# Altium schematic sheet Zynq_PS_System.SchDoc: Zynq PS System (part 1 of 2)
size A3; DrawnBy: Emre Can Damyanlı; Revision: A.1; SheetNumber: 5; SheetTotal: 7; ENG_APP_DATE: --/--/--; DSN_APP_DATE: --/--/--; CHK_APP_DATE: --/--/--
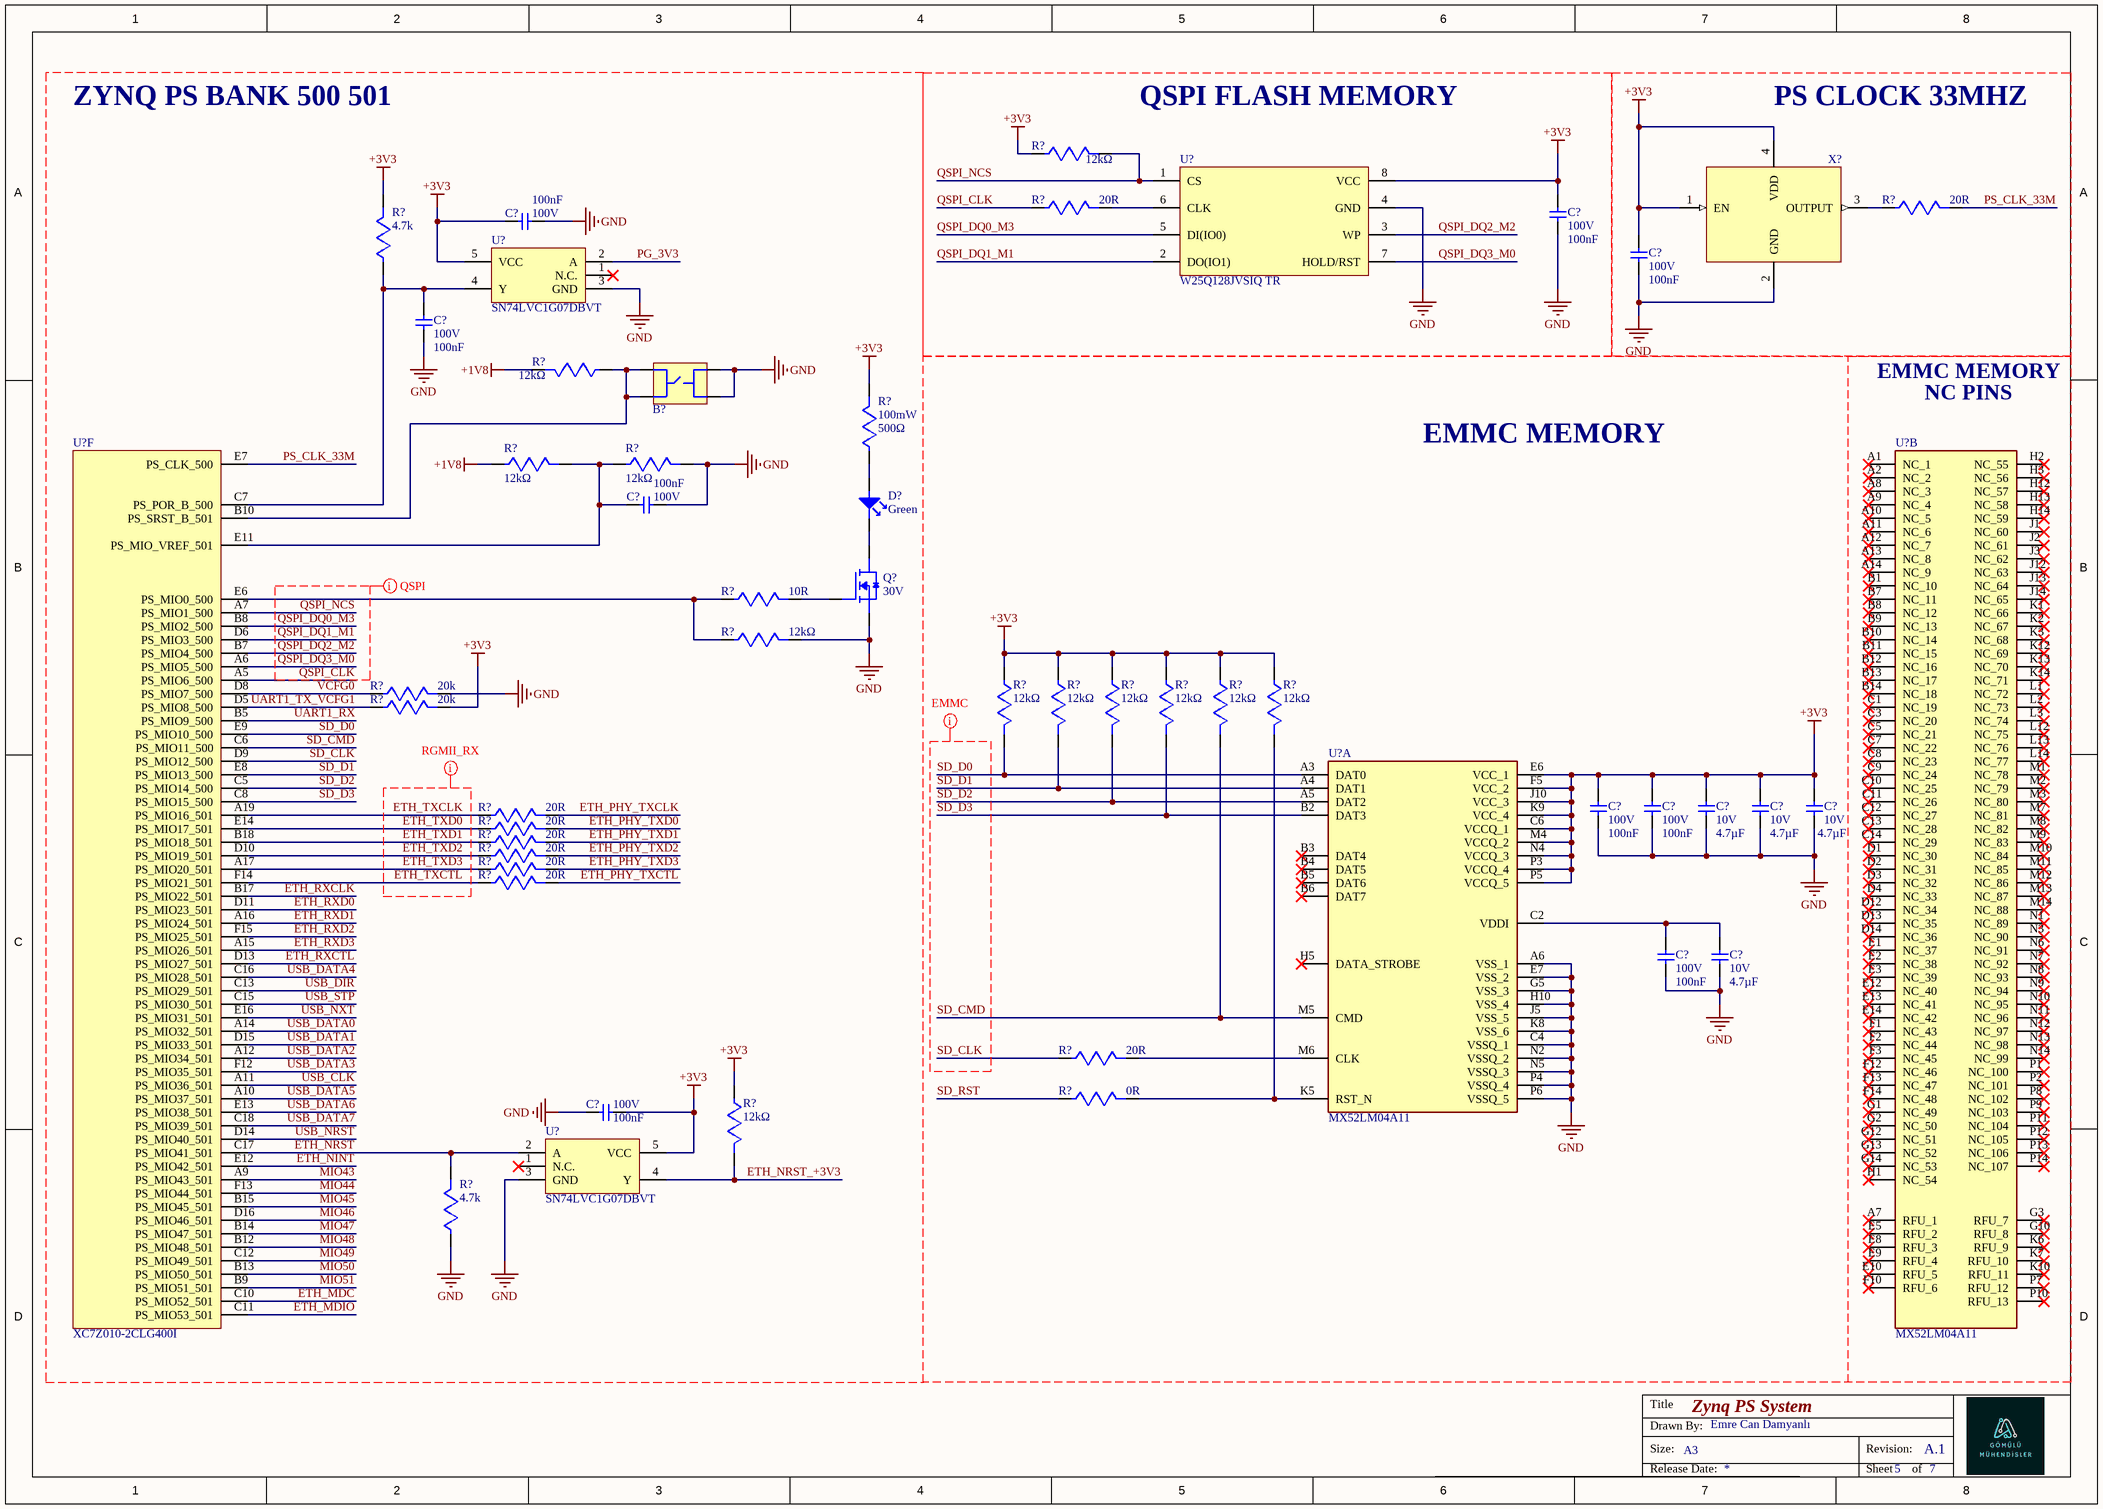
[diagram p0: Zynq_PS_System.SchDoc]

## Parts
(Parts that share a designator on the sheet are numbered #1, #2 ... from top to bottom, then left to right.)
B?  GSPTS0020  [SW4_PTS815 SJM 250 SMTR LFS_CNK]  (value not drawn)
C?#1  value 100nF  Voltage Rating: 100V  [CAPC1608X94N]  (hidden comment: GCJ188R72A104KA01D)
C?#2  value 100nF  Voltage Rating: 100V  [CAPC1608X94N]  (hidden comment: GCJ188R72A104KA01D)
C?#3  value 100nF  Voltage Rating: 100V  [CAPC1608X94N]  (hidden comment: GCJ188R72A104KA01D)
C?#4  value 100nF  Voltage Rating: 100V  [CAPC1608X94N]  (hidden comment: GCJ188R72A104KA01D)
C?#5  value 100nF  Voltage Rating: 100V  [CAPC1608X94N]  (hidden comment: GCJ188R72A104KA01D)
C?#6  value 100nF  Voltage Rating: 100V  [CAPC1608X94N]  (hidden comment: GCJ188R72A104KA01D)
C?#7  value 100nF  Voltage Rating: 100V  [CAPC1608X94N]  (hidden comment: GCJ188R72A104KA01D)
C?#8  value 4.7µF  Voltage Rating: 10V  [CAPC1005X55N]  (hidden comment: CL05A475MP5NRNC)
C?#9  value 4.7µF  Voltage Rating: 10V  [CAPC1005X55N]  (hidden comment: CL05A475MP5NRNC)
C?#10  value 4.7µF  Voltage Rating: 10V  [CAPC1005X55N]  (hidden comment: CL05A475MP5NRNC)
C?#11  value 100nF  Voltage Rating: 100V  [CAPC1608X94N]  (hidden comment: GCJ188R72A104KA01D)
C?#12  value 4.7µF  Voltage Rating: 10V  [CAPC1005X55N]  (hidden comment: CL05A475MP5NRNC)
C?#13  value 100nF  Voltage Rating: 100V  [CAPC1608X94N]  (hidden comment: GCJ188R72A104KA01D)
D?  Color: Green  [LED_0603_GREEN]  (hidden comment: LTST-C191KGKT)
Q?  Drain to Source Voltage (Vdss): 30V  [CDSOT23]  (hidden comment: DMG3402L-7)
R?#1  value 12kΩ  [RESISTOR_0603]  (hidden comment: RC0603FR-0712KL)
R?#2  value 20R  (hidden comment: RC0603FR-0720RL)
R?#3  value 20R  (hidden comment: RC0603FR-0720RL)
R?#4  value 4.7k  [RESISTOR_0603]  (hidden comment: RC0603FR-074K7L)
R?#5  value 12kΩ  [RESISTOR_0603]  (hidden comment: RC0603FR-0712KL)
R?#6  value 500Ω  Power Rating: 100mW  [RESISTOR_0603]  (hidden comment: RT0603BRC07500RL)
R?#7  value 12kΩ  [RESISTOR_0603]  (hidden comment: RC0603FR-0712KL)
R?#8  value 12kΩ  [RESISTOR_0603]  (hidden comment: RC0603FR-0712KL)
R?#9  value 10R  [RESISTOR_0603]  (hidden comment: RC0603FR-0710RL)
R?#10  value 12kΩ  [RESISTOR_0603]  (hidden comment: RC0603FR-0712KL)
R?#11  value 20k  [RESISTOR_0603]  (hidden comment: RC0603FR-0720KL)
R?#12  value 12kΩ  [RESISTOR_0603]  (hidden comment: RC0603FR-0712KL)
R?#13  value 12kΩ  [RESISTOR_0603]  (hidden comment: RC0603FR-0712KL)
R?#14  value 12kΩ  [RESISTOR_0603]  (hidden comment: RC0603FR-0712KL)
R?#15  value 12kΩ  [RESISTOR_0603]  (hidden comment: RC0603FR-0712KL)
R?#16  value 12kΩ  [RESISTOR_0603]  (hidden comment: RC0603FR-0712KL)
R?#17  value 12kΩ  [RESISTOR_0603]  (hidden comment: RC0603FR-0712KL)
R?#18  value 20k  [RESISTOR_0603]  (hidden comment: RC0603FR-0720KL)
R?#19  value 20R  (hidden comment: RC0603FR-0720RL)
R?#20  value 20R  (hidden comment: RC0603FR-0720RL)
R?#21  value 20R  (hidden comment: RC0603FR-0720RL)
R?#22  value 20R  (hidden comment: RC0603FR-0720RL)
R?#23  value 20R  (hidden comment: RC0603FR-0720RL)
R?#24  value 20R  (hidden comment: RC0603FR-0720RL)
R?#25  value 20R  (hidden comment: RC0603FR-0720RL)
R?#26  value 0R  [RESISTOR_0603]  (hidden comment: RC0603FR-070RL)
R?#27  value 12kΩ  [RESISTOR_0603]  (hidden comment: RC0603FR-0712KL)
R?#28  value 4.7k  [RESISTOR_0603]  (hidden comment: RC0603FR-074K7L)
U?#1  W25Q128JVSIQ TR  [SOIC127P790X216-8N]
U?#2  SN74LVC1G07DBVT  [SOT95P280X145-5N]
U?#3  XC7Z010-2CLG400I  [BGA400C80P20X20_1700X1700X160]  (part F of 9)
U?#4  MX52LM04A11  [BGA153C50P14X14_1150X1300X80]  (part B of 2)
U?#5  MX52LM04A11  [BGA153C50P14X14_1150X1300X80]  (part A of 2)
U?#6  SN74LVC1G07DBVT  [SOT95P280X145-5N]
X?  ECS-2520MV-333.3-BN-TR  [OSCCC250X200X90N]  (value not drawn)

## Nets
+1V8: R?#5.2 R?#7.1
+3V3: C?#1.2 C?#2.1 C?#3.1 C?#6.2 C?#7.2 C?#8.2 C?#9.2 C?#10.2 C?#13.2 R?#1.1 R?#4.2 R?#6.2 R?#12.1 R?#13.1 R?#14.1 R?#15.1 R?#16.1 R?#17.1 R?#18.2 R?#27.1 U?#1.8(VCC) U?#2.5(VCC) U?#5.C6(VCCQ_1) U?#5.E6(VCC_1) U?#5.F5(VCC_2) U?#5.J10(VCC_3) U?#5.K9(VCC_4) U?#5.M4(VCCQ_2) U?#5.N4(VCCQ_3) U?#5.P3(VCCQ_4) U?#5.P5(VCCQ_5) U?#6.5(VCC) X?.1(EN) X?.4(VDD)
GND: B?.3 B?.4 C?#1.1 C?#2.2 C?#3.2 C?#4.2 C?#5.1 C?#6.1 C?#7.1 C?#8.1 C?#9.1 C?#10.1 C?#11.1 C?#12.1 C?#13.1 Q?.2(S) R?#8.2 R?#10.2 R?#11.2 R?#28.1 U?#1.4(GND) U?#2.3(GND) U?#5.A6(VSS_1) U?#5.C4(VSSQ_1) U?#5.E7(VSS_2) U?#5.G5(VSS_3) U?#5.H10(VSS_4) U?#5.J5(VSS_5) U?#5.K8(VSS_6) U?#5.N2(VSSQ_2) U?#5.N5(VSSQ_3) U?#5.P4(VSSQ_4) U?#5.P6(VSSQ_5) U?#6.3(GND) X?.2(GND)
ETH_MDC: U?#3.C10(PS_MIO52_501)
ETH_MDIO: U?#3.C11(PS_MIO53_501)
ETH_NINT: U?#3.E12(PS_MIO42_501)
ETH_NRST: R?#28.2 U?#3.C17(PS_MIO41_501) U?#6.2(A)
ETH_NRST_+3V3: R?#27.2 U?#6.4(Y)
ETH_PHY_TXCLK: R?#19.2
ETH_PHY_TXCTL: R?#24.2
ETH_PHY_TXD0: R?#20.2
ETH_PHY_TXD1: R?#21.2
ETH_PHY_TXD2: R?#22.2
ETH_PHY_TXD3: R?#23.2
ETH_RXCLK: U?#3.B17(PS_MIO22_501)
ETH_RXCTL: U?#3.D13(PS_MIO27_501)
ETH_RXD0: U?#3.D11(PS_MIO23_501)
ETH_RXD1: U?#3.A16(PS_MIO24_501)
ETH_RXD2: U?#3.F15(PS_MIO25_501)
ETH_RXD3: U?#3.A15(PS_MIO26_501)
ETH_TXCLK: R?#19.1 U?#3.A19(PS_MIO16_501)
ETH_TXCTL: R?#24.1 U?#3.F14(PS_MIO21_501)
ETH_TXD0: R?#20.1 U?#3.E14(PS_MIO17_501)
ETH_TXD1: R?#21.1 U?#3.B18(PS_MIO18_501)
ETH_TXD2: R?#22.1 U?#3.D10(PS_MIO19_501)
ETH_TXD3: R?#23.1 U?#3.A17(PS_MIO20_501)
MIO43: U?#3.A9(PS_MIO43_501)
MIO44: U?#3.F13(PS_MIO44_501)
MIO45: U?#3.B15(PS_MIO45_501)
MIO46: U?#3.D16(PS_MIO46_501)
MIO47: U?#3.B14(PS_MIO47_501)
MIO48: U?#3.B12(PS_MIO48_501)
MIO49: U?#3.C12(PS_MIO49_501)
MIO50: U?#3.B13(PS_MIO50_501)
MIO51: U?#3.B9(PS_MIO51_501)
PG_3V3: U?#2.2(A)
PS_CLK_33M: R?#3.2 U?#3.E7(PS_CLK_500)
QSPI_CLK: R?#2.1 U?#3.A5(PS_MIO6_500)
QSPI_DQ0_M3: U?#1.5(DI(IO0)) U?#3.B8(PS_MIO2_500)
QSPI_DQ1_M1: U?#1.2(DO(IO1)) U?#3.D6(PS_MIO3_500)
QSPI_DQ2_M2: U?#1.3(WP) U?#3.B7(PS_MIO4_500)
QSPI_DQ3_M0: U?#1.7(HOLD/RST) U?#3.A6(PS_MIO5_500)
QSPI_NCS: R?#1.2 U?#1.1(CS) U?#3.A7(PS_MIO1_500)
SD_CLK: R?#25.1 U?#3.D9(PS_MIO12_500)
SD_CMD: R?#16.2 U?#3.C6(PS_MIO11_500) U?#5.M5(CMD)
SD_D0: R?#12.2 U?#3.E9(PS_MIO10_500) U?#5.A3(DAT0)
SD_D1: R?#13.2 U?#3.E8(PS_MIO13_500) U?#5.A4(DAT1)
SD_D2: R?#14.2 U?#3.C5(PS_MIO14_500) U?#5.A5(DAT2)
SD_D3: R?#15.2 U?#3.C8(PS_MIO15_500) U?#5.B2(DAT3)
SD_RST: R?#26.1
UART1_RX: U?#3.B5(PS_MIO9_500)
UART1_TX_VCFG1: R?#18.1 U?#3.D5(PS_MIO8_500)
USB_CLK: U?#3.A11(PS_MIO36_501)
USB_DATA0: U?#3.A14(PS_MIO32_501)
USB_DATA1: U?#3.D15(PS_MIO33_501)
USB_DATA2: U?#3.A12(PS_MIO34_501)
USB_DATA3: U?#3.F12(PS_MIO35_501)
USB_DATA4: U?#3.C16(PS_MIO28_501)
USB_DATA5: U?#3.A10(PS_MIO37_501)
USB_DATA6: U?#3.E13(PS_MIO38_501)
USB_DATA7: U?#3.C18(PS_MIO39_501)
USB_DIR: U?#3.C13(PS_MIO29_501)
USB_NRST: U?#3.D14(PS_MIO40_501)
USB_NXT: U?#3.E16(PS_MIO31_501)
USB_STP: U?#3.C15(PS_MIO30_501)
VCFG0: R?#11.1 U?#3.D8(PS_MIO7_500)
NetB?_1: B?.1 B?.2 R?#5.1 U?#3.B10(PS_SRST_B_501)
NetC?#4_1: C?#4.1 R?#4.1 U?#2.4(Y) U?#3.C7(PS_POR_B_500)
NetC?#5_2: C?#5.2 R?#7.2 R?#8.1 U?#3.E11(PS_MIO_VREF_501)
NetC?#11_2: C?#11.2 C?#12.2 U?#5.C2(VDDI)
NetD?_1: D?.1 R?#6.1
NetD?_2: D?.2 Q?.3(D)
NetQ?_1: Q?.1(G) R?#9.2
NetR?#2_2: R?#2.2 U?#1.6(CLK)
NetR?#3_1: R?#3.1 X?.3(OUTPUT)
NetR?#9_1: R?#9.1 R?#10.1 U?#3.E6(PS_MIO0_500)
NetR?#17_2: R?#17.2 R?#26.2 U?#5.K5(RST_N)
NetR?#25_2: R?#25.2 U?#5.M6(CLK)

Not connected (* = marked no-connect by the designer): U?#2 1(N.C.)*; U?#4 A1(NC_1)* A2(NC_2)* A7(RFU_1)* A8(NC_3)* A9(NC_4)* A10(NC_5)* A11(NC_6)* A12(NC_7)* A13(NC_8)* A14(NC_9)* B1(NC_10)* B7(NC_11)* B8(NC_12)* B9(NC_13)* B10(NC_14)* B11(NC_15)* B12(NC_16)* B13(NC_17)* B14(NC_18)* C1(NC_19)* C3(NC_20)* C5(NC_21)* C7(NC_22)* C8(NC_23)* C9(NC_24)* C10(NC_25)* C11(NC_26)* C12(NC_27)* C13(NC_28)* C14(NC_29)* D1(NC_30)* D2(NC_31)* D3(NC_32)* D4(NC_33)* D12(NC_34)* D13(NC_35)* D14(NC_36)* E1(NC_37)* E2(NC_38)* E3(NC_39)* E5(RFU_2)* E8(RFU_3)* E9(RFU_4)* E10(RFU_5)* E12(NC_40)* E13(NC_41)* E14(NC_42)* F1(NC_43)* F2(NC_44)* F3(NC_45)* F10(RFU_6)* F12(NC_46)* F13(NC_47)* F14(NC_48)* G1(NC_49)* G2(NC_50)* G3(RFU_7)* G10(RFU_8)* G12(NC_51)* G13(NC_52)* G14(NC_53)* H1(NC_54)* H2(NC_55)* H3(NC_56)* H12(NC_57)* H13(NC_58)* H14(NC_59)* J1(NC_60)* J2(NC_61)* J3(NC_62)* J12(NC_63)* J13(NC_64)* J14(NC_65)* K1(NC_66)* K2(NC_67)* K3(NC_68)* K6(RFU_9)* K7(RFU_10)* K10(RFU_11)* K12(NC_69)* K13(NC_70)* K14(NC_71)* L1(NC_72)* L2(NC_73)* L3(NC_74)* L12(NC_75)* L13(NC_76)* L14(NC_77)* M1(NC_78)* M2(NC_79)* M3(NC_80)* M7(NC_81)* M8(NC_82)* M9(NC_83)* M10(NC_84)* M11(NC_85)* M12(NC_86)* M13(NC_87)* M14(NC_88)* N1(NC_89)* N3(NC_90)* N6(NC_91)* N7(NC_92)* N8(NC_93)* N9(NC_94)* N10(NC_95)* N11(NC_96)* N12(NC_97)* N13(NC_98)* N14(NC_99)* P1(NC_100)* P2(NC_101)* P7(RFU_12)* P8(NC_102)* P9(NC_103)* P10(RFU_13)* P11(NC_104)* P12(NC_105)* P13(NC_106)* P14(NC_107)*; U?#5 B3(DAT4)* B4(DAT5)* B5(DAT6)* B6(DAT7)* H5(DATA_STROBE)*; U?#6 1(N.C.)*

## Layout directives
mark named RGMII_RX: ETH_TXCLK, ETH_TXCTL, ETH_TXD0, ETH_TXD1, ETH_TXD2, ETH_TXD3
mark named QSPI: QSPI_CLK, QSPI_DQ0_M3, QSPI_DQ1_M1, QSPI_DQ2_M2, QSPI_DQ3_M0, QSPI_NCS
mark named EMMC: SD_CLK, SD_CMD, SD_D0, SD_D1, SD_D2, SD_D3

## Notes on the sheet
- ZYNQ PS BANK 500 501
- QSPI FLASH MEMORY
- PS CLOCK 33MHZ
- EMMC MEMORY
- NC PINS
- Title
- Size:
- Drawn By:
- A3
- Revision:
- Release Date:
- Sheet
- of